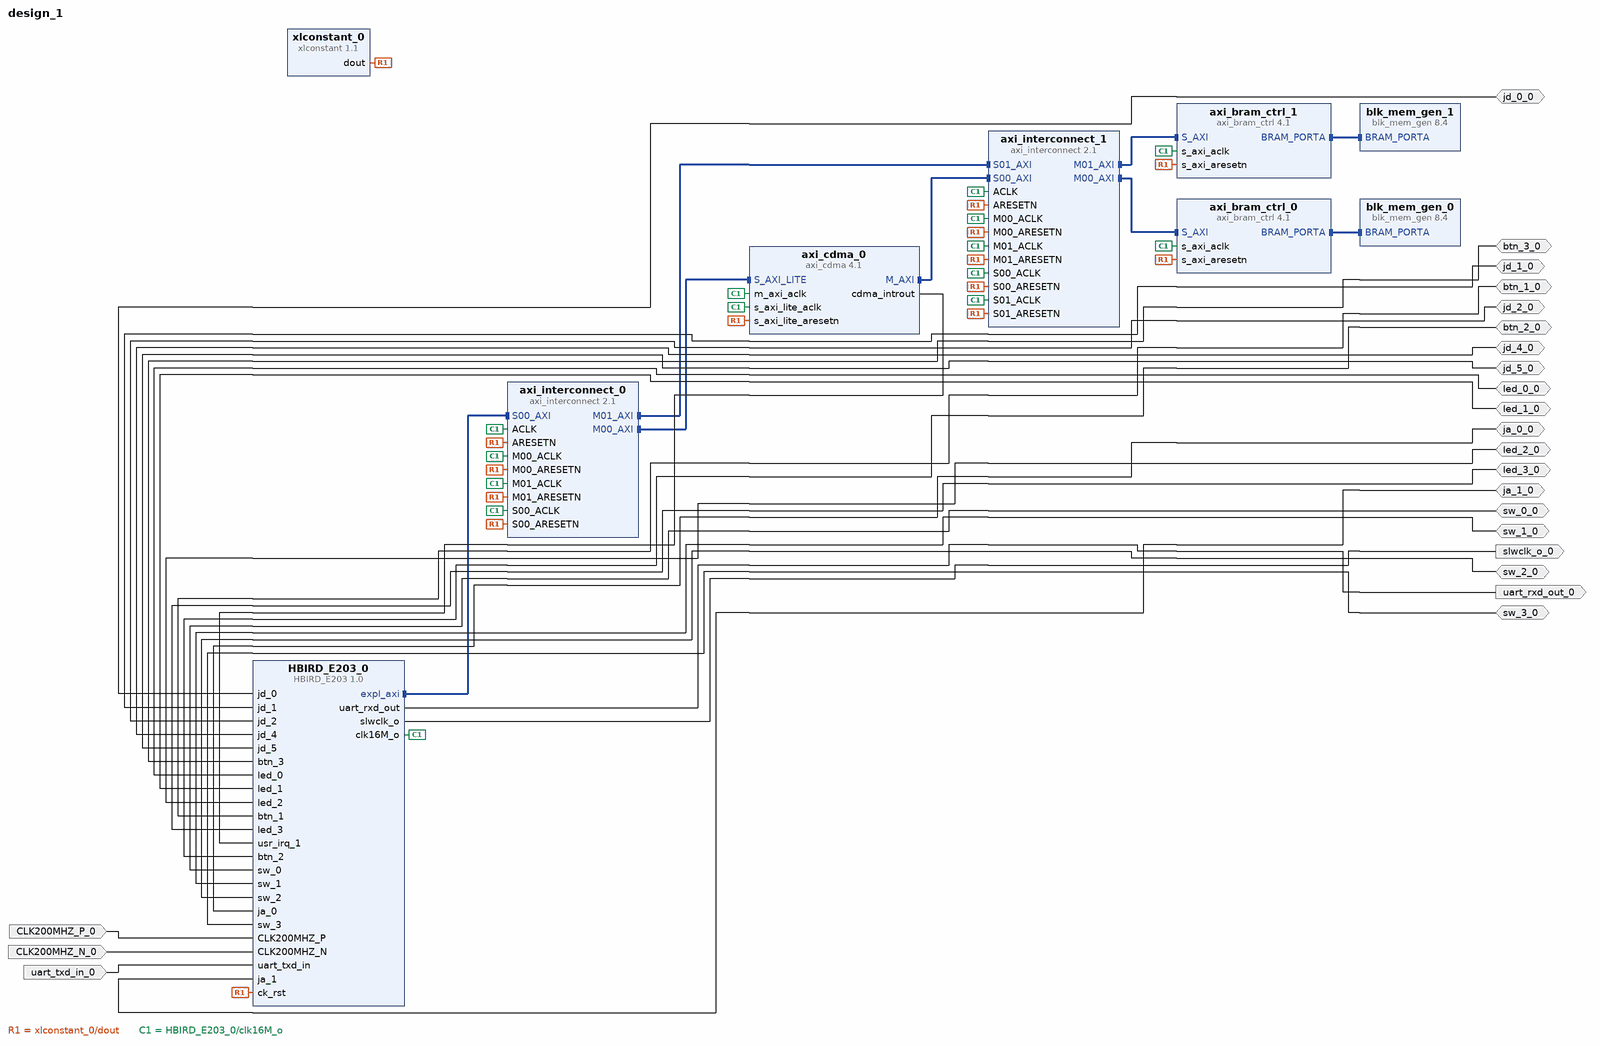
[diagram p0: block diagram of the top level]
# Vivado block design design_1, xc7z030fbg676-2, Vivado 2020.2
create_bd_design design_1

create_bd_port -dir IO jd_0_0
create_bd_port -dir IO jd_1_0
create_bd_port -dir IO jd_2_0
create_bd_port -dir IO jd_4_0
create_bd_port -dir IO jd_5_0
create_bd_port -dir IO btn_3_0
create_bd_port -dir O slwclk_o_0
create_bd_port -dir IO led_0_0
create_bd_port -dir IO led_1_0
create_bd_port -dir IO led_2_0
create_bd_port -dir I CLK200MHZ_P_0
create_bd_port -dir I CLK200MHZ_N_0
create_bd_port -dir O uart_rxd_out_0
create_bd_port -dir I uart_txd_in_0
create_bd_port -dir IO led_3_0
create_bd_port -dir IO btn_1_0
create_bd_port -dir IO btn_2_0
create_bd_port -dir IO sw_0_0
create_bd_port -dir IO sw_1_0
create_bd_port -dir IO sw_2_0
create_bd_port -dir IO sw_3_0
create_bd_port -dir IO ja_0_0
create_bd_port -dir IO ja_1_0

create_bd_cell -type ip -vlnv xilinx.com:ip:xlconstant:1.1 xlconstant_0
create_bd_cell -type ip -vlnv xilinx.com:ip:axi_interconnect:2.1 axi_interconnect_0
set_property -dict {CONFIG.ENABLE_ADVANCED_OPTIONS 0 CONFIG.NUM_MI 2 CONFIG.NUM_SI 1} [get_bd_cells axi_interconnect_0]
create_bd_cell -type ip -vlnv xilinx.com:ip:axi_bram_ctrl:4.1 axi_bram_ctrl_0
set_property -dict {CONFIG.SINGLE_PORT_BRAM 1} [get_bd_cells axi_bram_ctrl_0]
create_bd_cell -type ip -vlnv xilinx.com:ip:blk_mem_gen:8.4 blk_mem_gen_0
set_property -dict [list \
  CONFIG.EN_SAFETY_CKT false \
  CONFIG.Memory_Type Single_Port_RAM \
  CONFIG.Port_B_Clock 0 \
  CONFIG.Port_B_Enable_Rate 0 \
  CONFIG.Port_B_Write_Rate 0 \
] [get_bd_cells blk_mem_gen_0]
create_bd_cell -type ip -vlnv xilinx.com:ip:axi_bram_ctrl:4.1 axi_bram_ctrl_1
set_property -dict {CONFIG.SINGLE_PORT_BRAM 1} [get_bd_cells axi_bram_ctrl_1]
create_bd_cell -type ip -vlnv xilinx.com:ip:blk_mem_gen:8.4 blk_mem_gen_1
set_property -dict {CONFIG.EN_SAFETY_CKT false} [get_bd_cells blk_mem_gen_1]
create_bd_cell -type ip -vlnv xilinx.com:ip:axi_cdma:4.1 axi_cdma_0
create_bd_cell -type ip -vlnv xilinx.com:ip:axi_interconnect:2.1 axi_interconnect_1
set_property -dict {CONFIG.NUM_MI 2 CONFIG.NUM_SI 2} [get_bd_cells axi_interconnect_1]
create_bd_cell -type ip -vlnv HBIRD_E203:user:HBIRD_E203:1.0 HBIRD_E203_0

# ---- connections ----

connect_bd_intf_net [get_bd_intf_pins axi_interconnect_0/M00_AXI] [get_bd_intf_pins axi_cdma_0/S_AXI_LITE]
connect_bd_intf_net [get_bd_intf_pins axi_bram_ctrl_1/BRAM_PORTA] [get_bd_intf_pins blk_mem_gen_1/BRAM_PORTA]
connect_bd_intf_net [get_bd_intf_pins axi_bram_ctrl_0/BRAM_PORTA] [get_bd_intf_pins blk_mem_gen_0/BRAM_PORTA]
connect_bd_intf_net [get_bd_intf_pins HBIRD_E203_0/expl_axi] [get_bd_intf_pins axi_interconnect_0/S00_AXI]
connect_bd_intf_net [get_bd_intf_pins axi_interconnect_1/M01_AXI] [get_bd_intf_pins axi_bram_ctrl_1/S_AXI]
connect_bd_intf_net [get_bd_intf_pins axi_cdma_0/M_AXI] [get_bd_intf_pins axi_interconnect_1/S00_AXI]
connect_bd_intf_net [get_bd_intf_pins axi_interconnect_1/M00_AXI] [get_bd_intf_pins axi_bram_ctrl_0/S_AXI]
connect_bd_intf_net [get_bd_intf_pins axi_interconnect_0/M01_AXI] [get_bd_intf_pins axi_interconnect_1/S01_AXI]
connect_bd_net [get_bd_ports jd_0_0] [get_bd_pins HBIRD_E203_0/jd_0]
connect_bd_net [get_bd_ports jd_1_0] [get_bd_pins HBIRD_E203_0/jd_1]
connect_bd_net [get_bd_ports jd_2_0] [get_bd_pins HBIRD_E203_0/jd_2]
connect_bd_net [get_bd_ports jd_4_0] [get_bd_pins HBIRD_E203_0/jd_4]
connect_bd_net [get_bd_ports jd_5_0] [get_bd_pins HBIRD_E203_0/jd_5]
connect_bd_net [get_bd_ports btn_3_0] [get_bd_pins HBIRD_E203_0/btn_3]
connect_bd_net [get_bd_ports led_0_0] [get_bd_pins HBIRD_E203_0/led_0]
connect_bd_net [get_bd_ports led_1_0] [get_bd_pins HBIRD_E203_0/led_1]
connect_bd_net [get_bd_ports led_2_0] [get_bd_pins HBIRD_E203_0/led_2]
connect_bd_net -net CLK200MHZ_P_0_1 [get_bd_ports CLK200MHZ_P_0] [get_bd_pins HBIRD_E203_0/CLK200MHZ_P]
connect_bd_net -net CLK200MHZ_N_0_1 [get_bd_ports CLK200MHZ_N_0] [get_bd_pins HBIRD_E203_0/CLK200MHZ_N]
connect_bd_net [get_bd_pins HBIRD_E203_0/uart_rxd_out] [get_bd_ports uart_rxd_out_0]
connect_bd_net -net uart_txd_in_0_1 [get_bd_ports uart_txd_in_0] [get_bd_pins HBIRD_E203_0/uart_txd_in]
connect_bd_net [get_bd_ports led_3_0] [get_bd_pins HBIRD_E203_0/led_3]
connect_bd_net [get_bd_ports btn_1_0] [get_bd_pins HBIRD_E203_0/btn_1]
connect_bd_net [get_bd_ports btn_2_0] [get_bd_pins HBIRD_E203_0/btn_2]
connect_bd_net [get_bd_ports sw_0_0] [get_bd_pins HBIRD_E203_0/sw_0]
connect_bd_net [get_bd_ports sw_1_0] [get_bd_pins HBIRD_E203_0/sw_1]
connect_bd_net [get_bd_ports sw_2_0] [get_bd_pins HBIRD_E203_0/sw_2]
connect_bd_net [get_bd_ports sw_3_0] [get_bd_pins HBIRD_E203_0/sw_3]
connect_bd_net [get_bd_ports ja_0_0] [get_bd_pins HBIRD_E203_0/ja_0]
connect_bd_net [get_bd_ports ja_1_0] [get_bd_pins HBIRD_E203_0/ja_1]
connect_bd_net [get_bd_pins HBIRD_E203_0/slwclk_o] [get_bd_ports slwclk_o_0]
connect_bd_net [get_bd_pins xlconstant_0/dout] \
  [get_bd_pins axi_interconnect_0/ARESETN] [get_bd_pins axi_interconnect_0/S00_ARESETN] \
  [get_bd_pins axi_interconnect_0/M00_ARESETN] [get_bd_pins axi_bram_ctrl_1/s_axi_aresetn] \
  [get_bd_pins axi_bram_ctrl_0/s_axi_aresetn] [get_bd_pins axi_cdma_0/s_axi_lite_aresetn] \
  [get_bd_pins axi_interconnect_1/ARESETN] [get_bd_pins axi_interconnect_1/S00_ARESETN] \
  [get_bd_pins axi_interconnect_1/M00_ARESETN] [get_bd_pins axi_interconnect_1/M01_ARESETN] [get_bd_pins HBIRD_E203_0/ck_rst] \
  [get_bd_pins axi_interconnect_0/M01_ARESETN] [get_bd_pins axi_interconnect_1/S01_ARESETN]
connect_bd_net -net clk_wiz_0_clk_out1 [get_bd_pins HBIRD_E203_0/clk16M_o] \
  [get_bd_pins axi_interconnect_0/ACLK] [get_bd_pins axi_interconnect_0/S00_ACLK] [get_bd_pins axi_interconnect_0/M00_ACLK] \
  [get_bd_pins axi_bram_ctrl_0/s_axi_aclk] [get_bd_pins axi_bram_ctrl_1/s_axi_aclk] [get_bd_pins axi_cdma_0/m_axi_aclk] \
  [get_bd_pins axi_cdma_0/s_axi_lite_aclk] [get_bd_pins axi_interconnect_1/ACLK] [get_bd_pins axi_interconnect_1/S00_ACLK] \
  [get_bd_pins axi_interconnect_1/M00_ACLK] [get_bd_pins axi_interconnect_1/M01_ACLK] \
  [get_bd_pins axi_interconnect_0/M01_ACLK] [get_bd_pins axi_interconnect_1/S01_ACLK]
connect_bd_net [get_bd_pins axi_cdma_0/cdma_introut] [get_bd_pins HBIRD_E203_0/usr_irq_1]

# ---- address map ----
assign_bd_address -offset 0x10040000 -range 4K -target_address_space [get_bd_addr_spaces axi_cdma_0/Data] [get_bd_addr_segs axi_bram_ctrl_0/S_AXI/Mem0]
assign_bd_address -offset 0x10041000 -range 4K -target_address_space [get_bd_addr_spaces axi_cdma_0/Data] [get_bd_addr_segs axi_bram_ctrl_1/S_AXI/Mem0]
assign_bd_address -offset 0x10040000 -range 4K -target_address_space [get_bd_addr_spaces HBIRD_E203_0/expl_axi] [get_bd_addr_segs axi_bram_ctrl_0/S_AXI/Mem0]
assign_bd_address -offset 0x10041000 -range 4K -target_address_space [get_bd_addr_spaces HBIRD_E203_0/expl_axi] [get_bd_addr_segs axi_bram_ctrl_1/S_AXI/Mem0]
assign_bd_address -offset 0x10042000 -range 4K -target_address_space [get_bd_addr_spaces HBIRD_E203_0/expl_axi] [get_bd_addr_segs axi_cdma_0/S_AXI_LITE/Reg]

validate_bd_design
save_bd_design
